# Altium schematic sheet TankBoardSheet2.SchDoc
size A
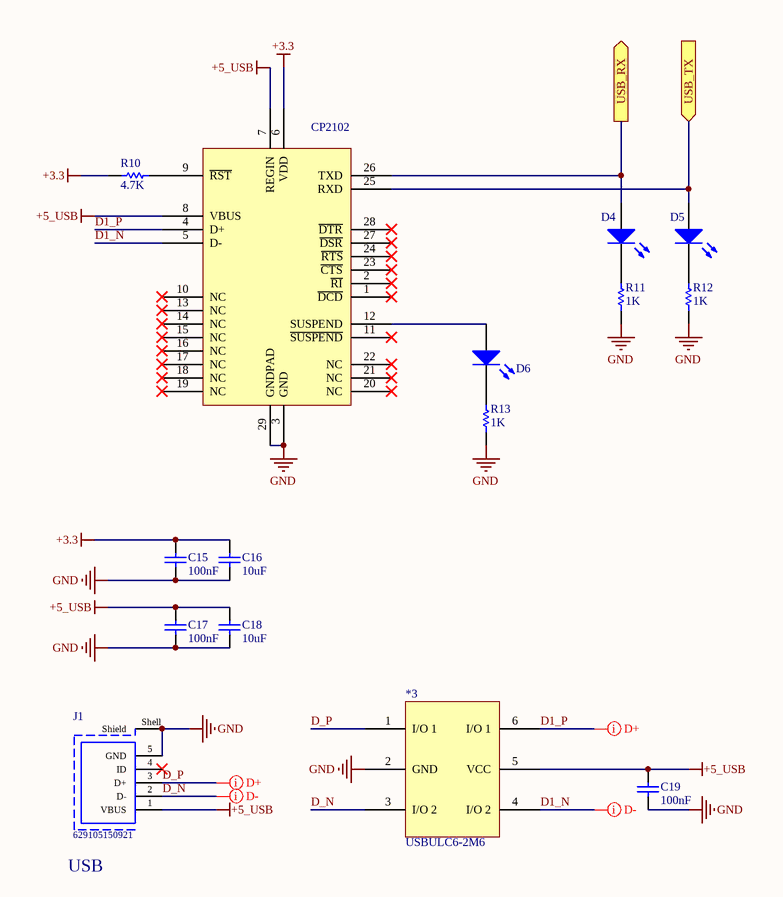
[diagram p0: TankBoardSheet2.SchDoc]

## Parts
*2  CP2102  [QFN50P500X500X90_HS-29N]
*3  USBULC6-2M6  [QFN50P100X145X60-6N]
C15  value 100nF  [CAP-SM-0603]  (hidden comment: Cap Non-Pol SMD)
C16  value 10uF  [CAP-SM-0603]  (hidden comment: Cap Non-Pol SMD)
C17  value 100nF  [CAP-SM-0603]  (hidden comment: Cap Non-Pol SMD)
C18  value 10uF  [CAP-SM-0603]  (hidden comment: Cap Non-Pol SMD)
C19  value 100nF  [CAP-SM-0603]  (hidden comment: Cap Non-Pol SMD)
D4  LED SMD  [LED_0603_Blue]  (value not drawn)
D5  LED SMD  [LED_0603_Blue]  (value not drawn)
D6  LED SMD  [LED_0603_Blue]  (value not drawn)
J1  629105150921  [629105150921]
R10  value 4.7K  [RES-SM-0603]  (hidden comment: RESISTOR SMD)
R11  value 1K  [RES-SM-0603]  (hidden comment: RESISTOR SMD)
R12  value 1K  [RES-SM-0603]  (hidden comment: RESISTOR SMD)
R13  value 1K  [RES-SM-0603]  (hidden comment: RESISTOR SMD)

## Ports
USB_RX (out), USB_TX (in)

## Nets
+3.3: *2.6(VDD) C15.1 C16.1 R10.2
+5_USB: *2.7(REGIN) *2.8(VBUS) *3.5(VCC) C17.1 C18.1 C19.1 J1.1(VBUS)
GND: *2.3(GND) *2.29(GNDPAD) *3.2(GND) C15.2 C16.2 C17.2 C18.2 C19.2 J1.5(GND) J1.Shell(Shield) R11.1 R12.1 R13.1
D1_N: *2.5(D-) *3.4(I/O_2)
D1_P: *2.4(D+) *3.6(I/O_1)
D_N: *3.3(I/O_2) J1.2(D-)
D_P: *3.1(I/O_1) J1.3(D+)
USB_RX: *2.26(TXD) D4.1(A) ; port USB_RX
USB_TX: *2.25(RXD) D5.1(A) ; port USB_TX
Net*2_9: *2.9(~{RST}) R10.1
Net*2_12: *2.12(SUSPEND) D6.1(A)
NetD4_2: D4.2(K) R11.2
NetD5_2: D5.2(K) R12.2
NetD6_2: D6.2(K) R13.2

Not connected (* = marked no-connect by the designer): *2 1(~{DCD})* 2(~{RI})* 10(NC)* 11(~{SUSPEND})* 13(NC)* 14(NC)* 15(NC)* 16(NC)* 17(NC)* 18(NC)* 19(NC)* 20(NC)* 21(NC)* 22(NC)* 23(~{CTS})* 24(~{RTS})* 27(~{DSR})* 28(~{DTR})*; J1 4(ID)*

## Layout directives
differential pair: D1_N, D1_P, D_N, D_P

## Notes on the sheet
- USB

## Library data of the parts
C15-C19 = Cap Non-Pol SMD: Capacitor
D4-D6 = LED SMD: LED
J1 = 629105150921: Micro USB 2.0 Type AB Receptacle WR-COM, Horizontal, SMT; Rated Current: 1.8 A; Contact Resistance: 30 mOhm; Working Voltage: 30 VAC; ComponentLink1Description: Manufacturer; ComponentLink1URL: http://www.we-online.de; ComponentLink2Description: Datasheet; ComponentLink2URL: https://katalog.we-online.de/em/datasheet/629105150921.pdf; Part Number: 629105150921; Published Date: September 2018; Publisher: Wurth Elektronik; Orientation: Horizontal; Connector Type: Micro USB 2.0 Type AB; Operating Temperature: -40 to 85 degC; Mounting Technology: SMT; Gender: Receptacle; Packaging: Tape and Reel
R10-R13 = RESISTOR SMD: Resistor